# Altium schematic sheet 10-RJ45_Protection.SchDoc
size B; SheetNumber: 10; SheetTotal: 11
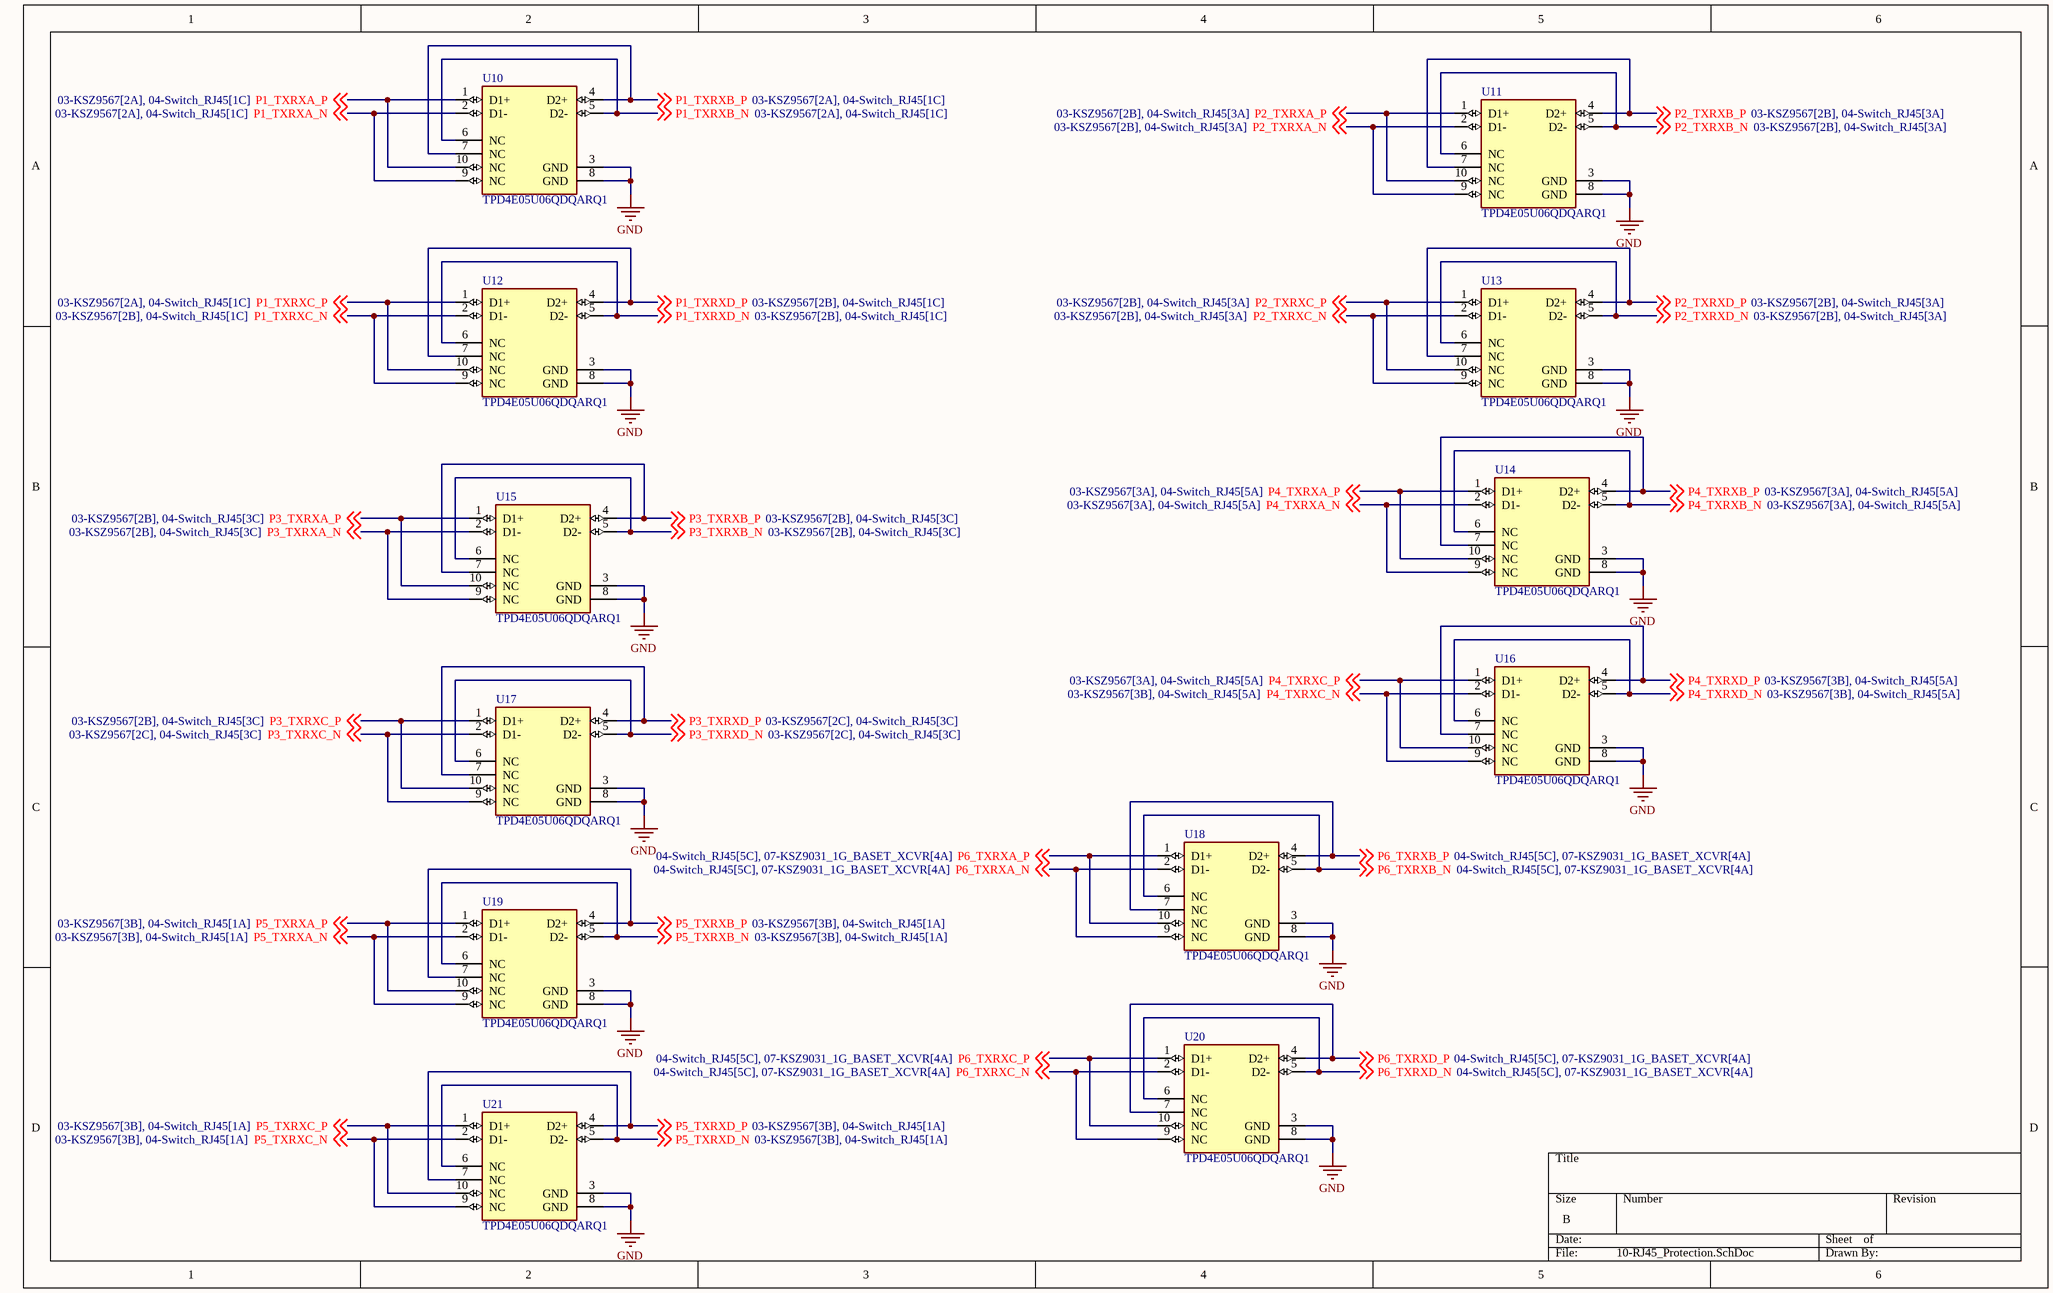
[diagram p0: 10-RJ45_Protection.SchDoc]

## Parts
U10  TPD4E05U06QDQARQ1  [FP-DQA0010A-MFG]
U11  TPD4E05U06QDQARQ1  [FP-DQA0010A-MFG]
U12  TPD4E05U06QDQARQ1  [FP-DQA0010A-MFG]
U13  TPD4E05U06QDQARQ1  [FP-DQA0010A-MFG]
U14  TPD4E05U06QDQARQ1  [FP-DQA0010A-MFG]
U15  TPD4E05U06QDQARQ1  [FP-DQA0010A-MFG]
U16  TPD4E05U06QDQARQ1  [FP-DQA0010A-MFG]
U17  TPD4E05U06QDQARQ1  [FP-DQA0010A-MFG]
U18  TPD4E05U06QDQARQ1  [FP-DQA0010A-MFG]
U19  TPD4E05U06QDQARQ1  [FP-DQA0010A-MFG]
U20  TPD4E05U06QDQARQ1  [FP-DQA0010A-MFG]
U21  TPD4E05U06QDQARQ1  [FP-DQA0010A-MFG]

## Nets
GND: U10.3(GND) U10.8(GND) U11.3(GND) U11.8(GND) U12.3(GND) U12.8(GND) U13.3(GND) U13.8(GND) U14.3(GND) U14.8(GND) U15.3(GND) U15.8(GND) U16.3(GND) U16.8(GND) U17.3(GND) U17.8(GND) U18.3(GND) U18.8(GND) U19.3(GND) U19.8(GND) U20.3(GND) U20.8(GND) U21.3(GND) U21.8(GND)
P1_TXRXA_N: U10.2(D1-) U10.9(NC) ; off-sheet P1_TXRXA_N
P1_TXRXA_P: U10.1(D1+) U10.10(NC) ; off-sheet P1_TXRXA_P
P1_TXRXB_N: U10.5(D2-) U10.6(NC) ; off-sheet P1_TXRXB_N
P1_TXRXB_P: U10.4(D2+) U10.7(NC) ; off-sheet P1_TXRXB_P
P1_TXRXC_N: U12.2(D1-) U12.9(NC) ; off-sheet P1_TXRXC_N
P1_TXRXC_P: U12.1(D1+) U12.10(NC) ; off-sheet P1_TXRXC_P
P1_TXRXD_N: U12.5(D2-) U12.6(NC) ; off-sheet P1_TXRXD_N
P1_TXRXD_P: U12.4(D2+) U12.7(NC) ; off-sheet P1_TXRXD_P
P2_TXRXA_N: U11.2(D1-) U11.9(NC) ; off-sheet P2_TXRXA_N
P2_TXRXA_P: U11.1(D1+) U11.10(NC) ; off-sheet P2_TXRXA_P
P2_TXRXB_N: U11.5(D2-) U11.6(NC) ; off-sheet P2_TXRXB_N
P2_TXRXB_P: U11.4(D2+) U11.7(NC) ; off-sheet P2_TXRXB_P
P2_TXRXC_N: U13.2(D1-) U13.9(NC) ; off-sheet P2_TXRXC_N
P2_TXRXC_P: U13.1(D1+) U13.10(NC) ; off-sheet P2_TXRXC_P
P2_TXRXD_N: U13.5(D2-) U13.6(NC) ; off-sheet P2_TXRXD_N
P2_TXRXD_P: U13.4(D2+) U13.7(NC) ; off-sheet P2_TXRXD_P
P3_TXRXA_N: U15.2(D1-) U15.9(NC) ; off-sheet P3_TXRXA_N
P3_TXRXA_P: U15.1(D1+) U15.10(NC) ; off-sheet P3_TXRXA_P
P3_TXRXB_N: U15.5(D2-) U15.6(NC) ; off-sheet P3_TXRXB_N
P3_TXRXB_P: U15.4(D2+) U15.7(NC) ; off-sheet P3_TXRXB_P
P3_TXRXC_N: U17.2(D1-) U17.9(NC) ; off-sheet P3_TXRXC_N
P3_TXRXC_P: U17.1(D1+) U17.10(NC) ; off-sheet P3_TXRXC_P
P3_TXRXD_N: U17.5(D2-) U17.6(NC) ; off-sheet P3_TXRXD_N
P3_TXRXD_P: U17.4(D2+) U17.7(NC) ; off-sheet P3_TXRXD_P
P4_TXRXA_N: U14.2(D1-) U14.9(NC) ; off-sheet P4_TXRXA_N
P4_TXRXA_P: U14.1(D1+) U14.10(NC) ; off-sheet P4_TXRXA_P
P4_TXRXB_N: U14.5(D2-) U14.6(NC) ; off-sheet P4_TXRXB_N
P4_TXRXB_P: U14.4(D2+) U14.7(NC) ; off-sheet P4_TXRXB_P
P4_TXRXC_N: U16.2(D1-) U16.9(NC) ; off-sheet P4_TXRXC_N
P4_TXRXC_P: U16.1(D1+) U16.10(NC) ; off-sheet P4_TXRXC_P
P4_TXRXD_N: U16.5(D2-) U16.6(NC) ; off-sheet P4_TXRXD_N
P4_TXRXD_P: U16.4(D2+) U16.7(NC) ; off-sheet P4_TXRXD_P
P5_TXRXA_N: U19.2(D1-) U19.9(NC) ; off-sheet P5_TXRXA_N
P5_TXRXA_P: U19.1(D1+) U19.10(NC) ; off-sheet P5_TXRXA_P
P5_TXRXB_N: U19.5(D2-) U19.6(NC) ; off-sheet P5_TXRXB_N
P5_TXRXB_P: U19.4(D2+) U19.7(NC) ; off-sheet P5_TXRXB_P
P5_TXRXC_N: U21.2(D1-) U21.9(NC) ; off-sheet P5_TXRXC_N
P5_TXRXC_P: U21.1(D1+) U21.10(NC) ; off-sheet P5_TXRXC_P
P5_TXRXD_N: U21.5(D2-) U21.6(NC) ; off-sheet P5_TXRXD_N
P5_TXRXD_P: U21.4(D2+) U21.7(NC) ; off-sheet P5_TXRXD_P
P6_TXRXA_N: U18.2(D1-) U18.9(NC) ; off-sheet P6_TXRXA_N
P6_TXRXA_P: U18.1(D1+) U18.10(NC) ; off-sheet P6_TXRXA_P
P6_TXRXB_N: U18.5(D2-) U18.6(NC) ; off-sheet P6_TXRXB_N
P6_TXRXB_P: U18.4(D2+) U18.7(NC) ; off-sheet P6_TXRXB_P
P6_TXRXC_N: U20.2(D1-) U20.9(NC) ; off-sheet P6_TXRXC_N
P6_TXRXC_P: U20.1(D1+) U20.10(NC) ; off-sheet P6_TXRXC_P
P6_TXRXD_N: U20.5(D2-) U20.6(NC) ; off-sheet P6_TXRXD_N
P6_TXRXD_P: U20.4(D2+) U20.7(NC) ; off-sheet P6_TXRXD_P

## Library data of the parts
U10-U21 = CMP-04985-000004-1: TVS DIODE 5.5V 14V 10USON; Manufacturer: Texas Instruments; Direction: Unidirectional; Standoff Height: 0mm; Capacitance: 0.5pF; Number Of Channels: 4; Breakdown Voltage: 6.4V; Peak Pulse Power: 2.5W; Automotive Grade: Grade 1; Value: 0.5pF; Interface: USB,Ethernet,LVDS,Other; Peak Pulse Current: 2.5A; Operating Supply Voltage: 5.5V; Reverse Standoff Voltage: 5.5V; Package: DQA0010A; Temperature Range Low: -40°C; Temperature Range High: +125°C; Ambient Temperature Range Low: -40°C; Device Class L1: Circuit Protection; Clamping Voltage: 14V; Manufacturer Part Number: TPD4E05U06QDQARQ1; Device Class L2: ESD and Circuit Protection ICs; Octopart: https://octopart.com/tpd4e05u06qdqarq1-texas+instruments-48523459; Device Class L3: unset; Height: 0.55mm; Automotive: Yes; ComponentLink2Description: Datasheet; RoHS: TRUE; Ambient Temperature Range High: +125°C; Category: IC; Mouser Description: Automotive 4-Channel ESD Protection Solution for SuperSpeed (up to 5 Gbps) Interface 10-USON -40 to 125; Temperature: -40°C to +125°C; ComponentLink2URL: http://www.ti.com/lit/ds/symlink/tpd4e05u06-q1.pdf; Digikey Description: TVS DIODE 5.5V 14V 10USON; Lead Free: Yes